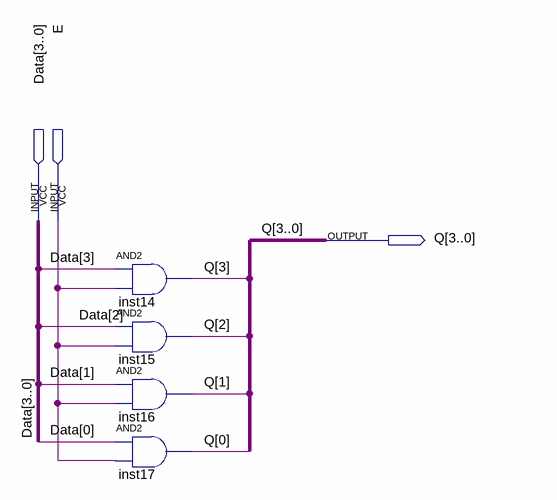
[diagram p0: schematic sheet]
// Quartus schematic BusEnable.bdf as structural Verilog: 4 symbols, 3 pins
module BusEnable (
  input  [3:0] Data,
  input  E,
  output [3:0] Q
);

  and inst14 (Q[3], Data[3], E);
  and inst15 (Q[2], Data[2], E);
  and inst16 (Q[1], Data[1], E);
  and inst17 (Q[0], Data[0], E);
endmodule
